# Altium project Ej2_Rauch.PrjPcb
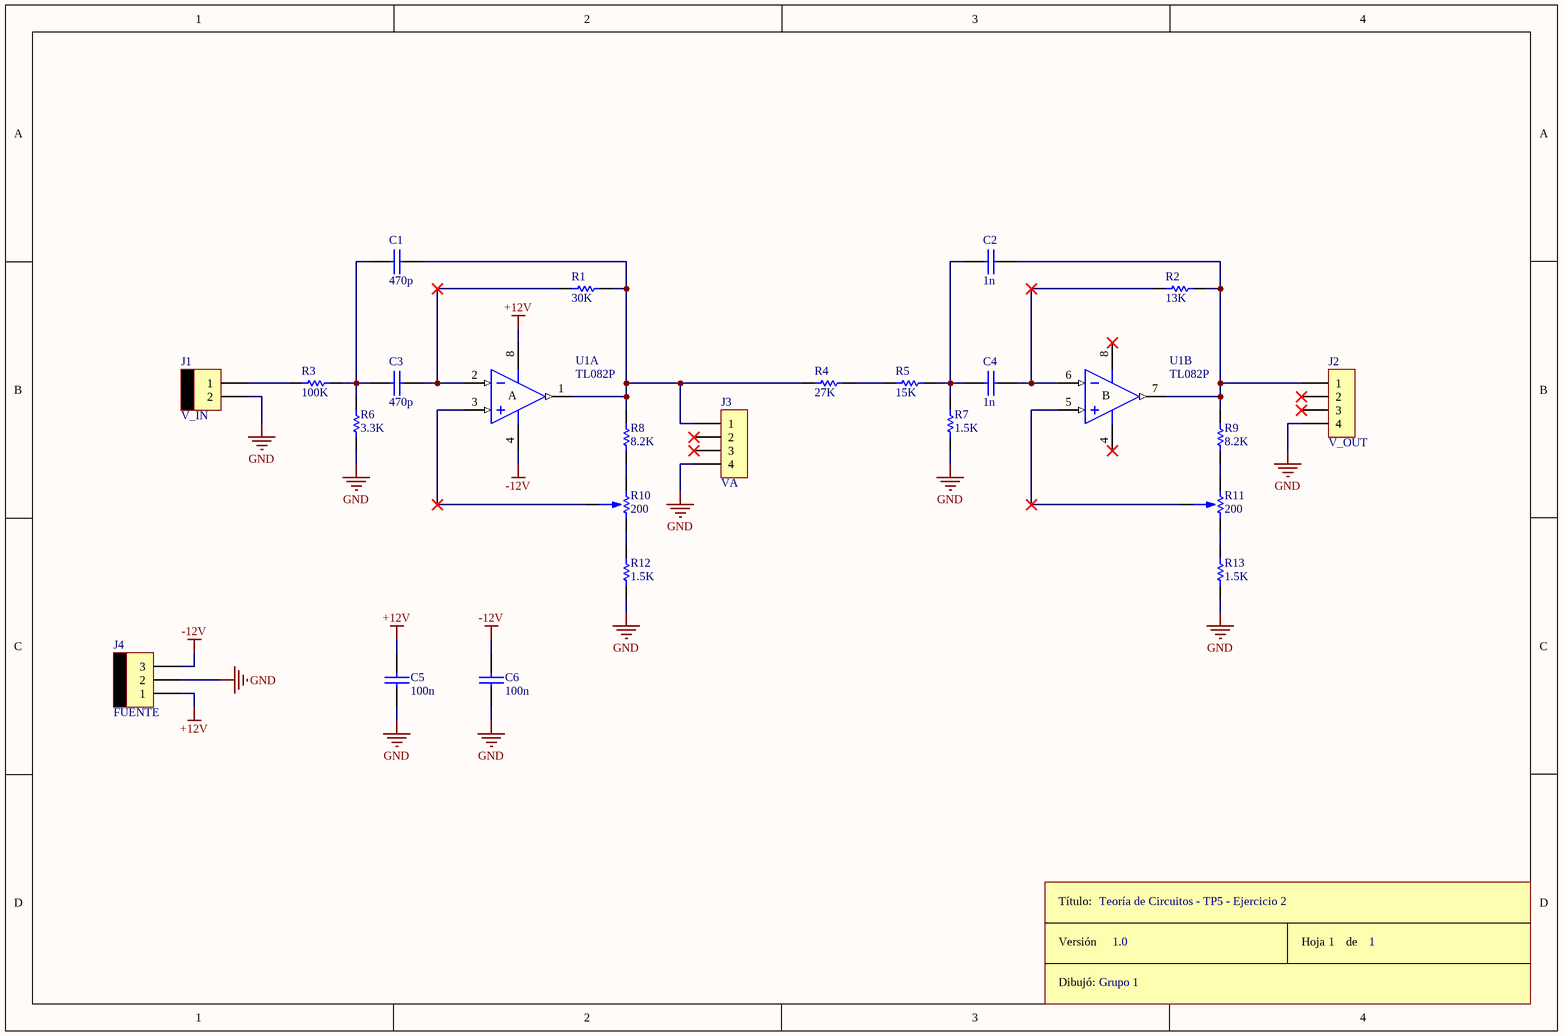
[diagram p0: RauchPBEsquematico.SchDoc]
1 sheet, 25 parts. Net scope: global (net labels, ports and power ports of the same name join across sheets).
Board file: RauchPB_Placa.PcbDoc

## Sheet RauchPBEsquematico.SchDoc
size A4

### Parts
C1  470p  [CAP100]
C2  1n  [CAP100]
C3  470p  [CAP100]
C4  1n  [CAP100]
C5  100n  [CAP100]
C6  100n  [CAP100]
J1  V_IN  [MOLEX2]
J2  V_OUT  [SIP4]
J3  VA  [SIP4]
J4  FUENTE  [MOLEX3]
R1  30K  [RES400]
R2  13K  [RES400]
R3  100K  [RES300]
R4  27K  [RES300]
R5  15K  [RES300]
R6  3.3K  [RES400]
R7  1.5K  [RES400]
R8  8.2K  [RES300]
R9  8.2K  [RES300]
R10  200  [PRESET V]
R11  200  [PRESET V]
R12  1.5K  [RES300]
R13  1.5K  [RES300]
ROT1  Rótulo  (value not drawn)
U1  TL082P  [P008]  (parts A,B of 2)

### Nets
+12V: C5.1 J4.1 U1.8(V+)
-12V: C6.1 J4.3 U1.4(V-)
GND: C5.2 C6.2 J1.2 J2.4 J3.4 J4.2 R6.1 R7.1 R12.1 R13.1
NetC1_1: C1.1 C3.1 R3.2 R6.2
NetC1_2: C1.2 J3.1 R1.2 R4.1 R8.2 U1.1(OUT)
NetC2_1: C2.1 C4.1 R5.2 R7.2
NetC2_2: C2.2 J2.1 R2.2 R9.2 U1.7(OUT)
NetC3_2: C3.2 R1.1 U1.2(IN-)
NetC4_2: C4.2 R2.1 U1.6(IN-)
NetJ1_1: J1.1 R3.1
NetR4_2: R4.2 R5.1
NetR8_1: R8.1 R10.3
NetR9_1: R9.1 R11.3
NetR10_1: R10.1 R12.2
NetR10_2: R10.2 U1.3(IN+)
NetR11_1: R11.1 R13.2
NetR11_2: R11.2 U1.5(IN+)

Not connected (* = marked no-connect by the designer): J2 2* 3*; J3 2* 3*

### Notes on the sheet
- Teoría de Circuitos - TP5 - Ejercicio 2
- Grupo 1
- 1.0
- 1
- (in symbol Rótulo) Título:; Versión; Hoja       de; Dibujó:
- (in symbol TL082P, part A) A
- (in symbol TL082P, part B) B

### Library data of the parts
C1-C6 = CAP
J1 = MOLEX2
J2 J3 = CON4
J4 = MOLEX3
R1-R9 R12 R13 = RES
R10 R11 = PRESET
U1 = TL082P: JFET-Input Operational Amplifier; Published: 16-Jan-2001; LatestRevisionDate: 04-Mar-2005; LatestRevisionNote: Stylized 3D Model Added.; DatasheetVersion: Feb-1999; PackageVersion: Jun-1999; PackageReference: P008; Publisher: Altium Limited; PackageDescription: DIP; 8 Leads; Row Spacing 7.62 mm; Pitch 2.54 mm; Code_JEDEC: MO-001-AN; ComponentLink1Description: Manufacturer Link; ComponentLink1URL: http://www.ti.com/; ComponentLink2Description: Datasheet; ComponentLink2URL: http://www-s.ti.com/sc/ds/tl082.pdf